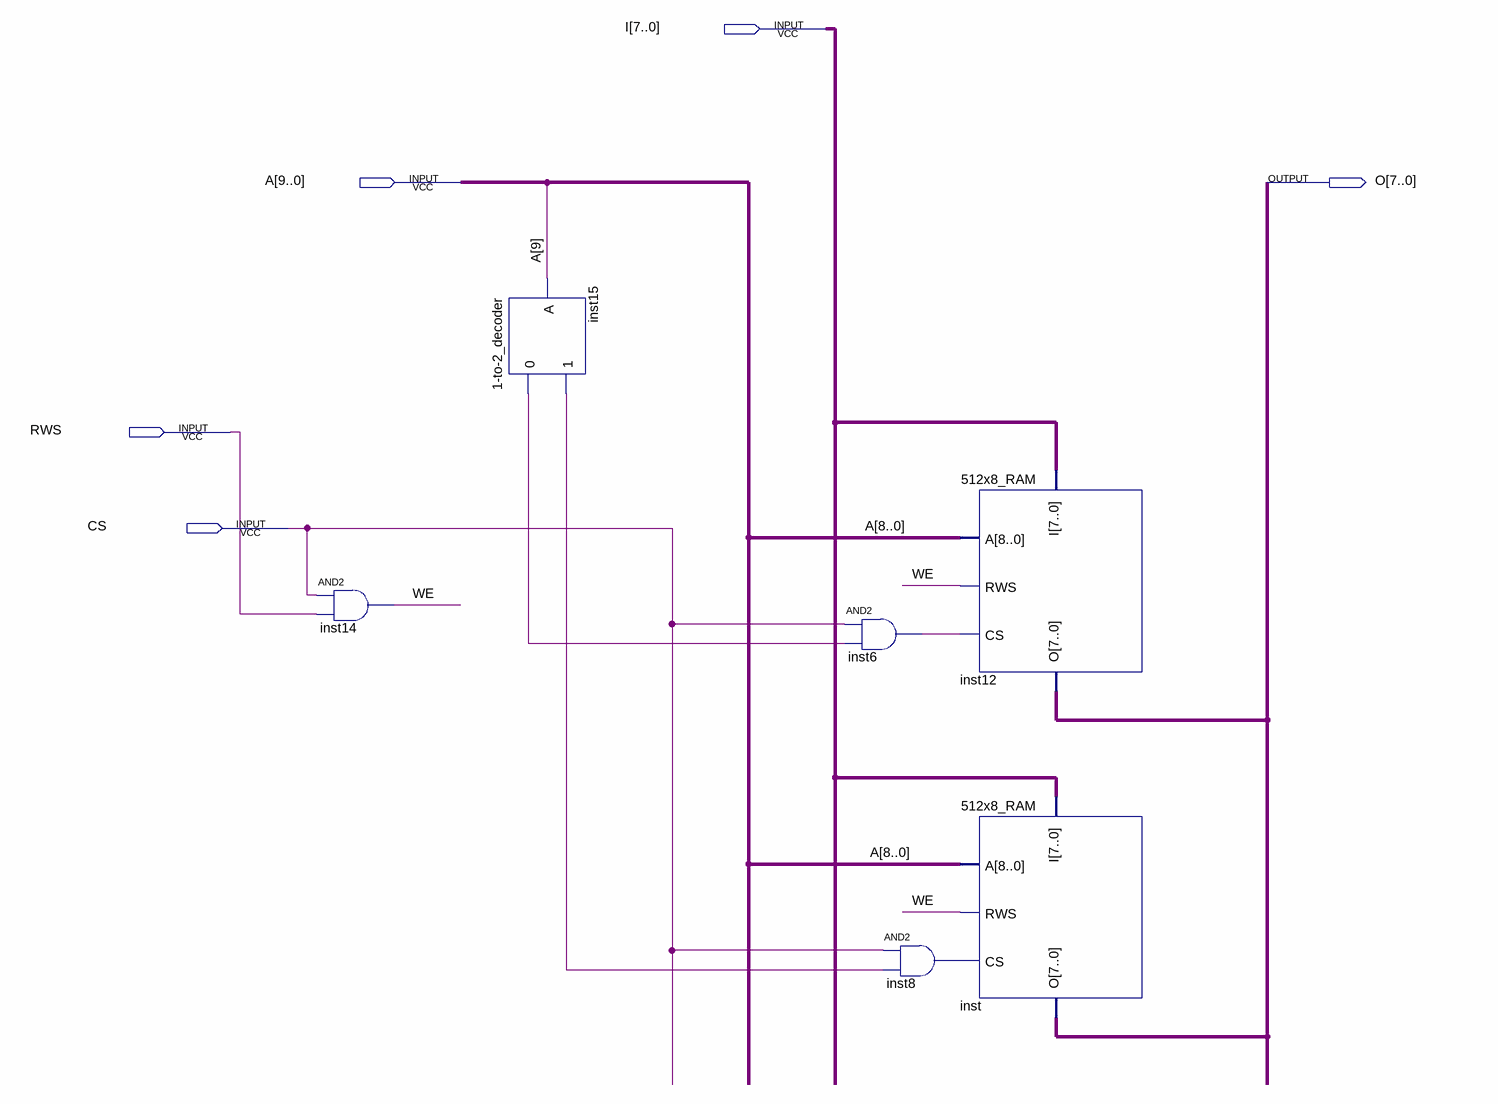
[diagram p0: schematic sheet]
// Quartus schematic 1024x8_RAM.bdf as structural Verilog: 6 symbols, 5 pins
module \1024x8_RAM  (
  input  [7:0] I,
  input  [9:0] A,
  input  RWS,
  input  CS,
  output [7:0] O
);

  wire inst6_out, inst8_out, inst15_0, inst15_1, WE;

  and inst14 (WE, CS, RWS);
  \1-to-2_decoder  inst15 (.A(A[9]), .\0 (inst15_0), .\1 (inst15_1));
  and inst6 (inst6_out, CS, inst15_0);
  and inst8 (inst8_out, CS, inst15_1);
  \512x8_RAM  inst12 (.I(I), .A(A[8:0]), .RWS(WE), .CS(inst6_out), .O(O));
  \512x8_RAM  inst (.I(I), .A(A[8:0]), .RWS(WE), .CS(inst8_out), .O(O));
endmodule
